# EAGLE design bridge (EAGLE 5.03)
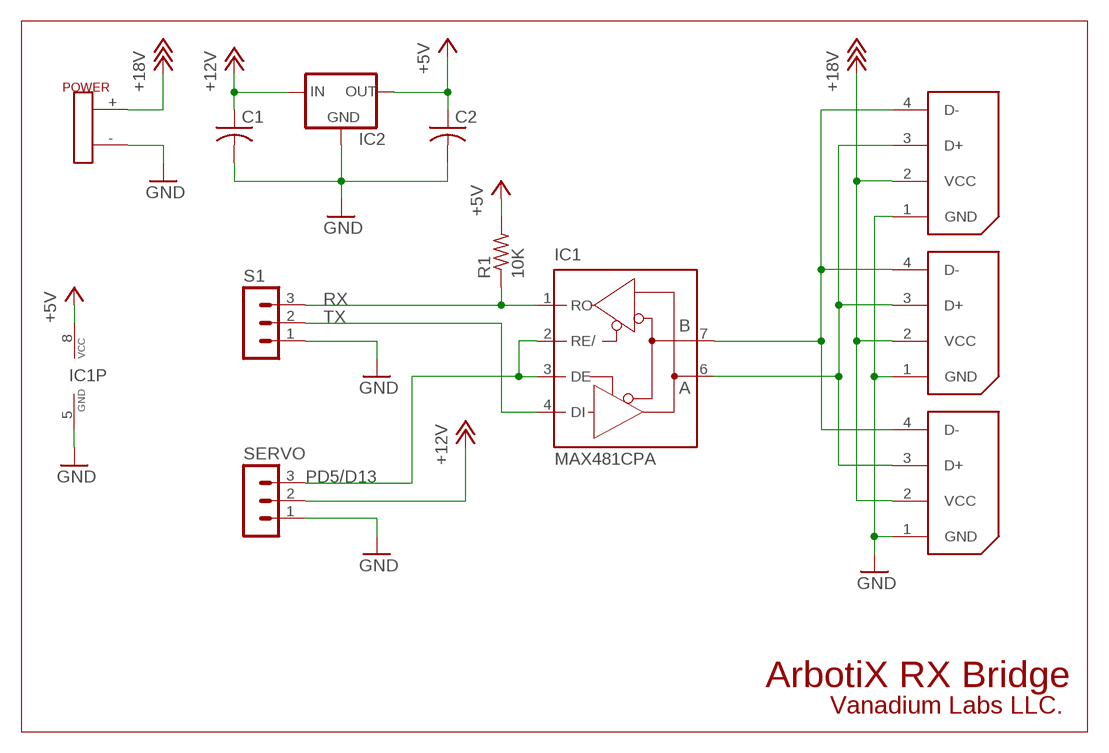
[diagram p0: schematic, sheet 1]

## Parts
C1  C-US025-025X050  [C025-025X050]
C2  C-US025-025X050  [C025-025X050]
IC1  MAX481CPA  [DIL08]
IC2  78LXX  [78LXX]
POWER  POWER  [POWER]
R1  10K  R-US_0204/5  [0204/5]
S1  MA03-1  [MA03-1]
SERVO  MA03-1  [MA03-1]
U$3  RX-64  [WM18888-ND]
U$4  RX-64  [WM18888-ND]
U$5  RX-64  [WM18888-ND]

## Nets
+5V: C2.1 IC1.8(VCC) IC2.OUT R1.2
+12V: C1.1 IC2.IN SERVO.2
+18V: POWER.+ U$3.2(VCC) U$4.2(VCC) U$5.2(VCC)
GND: C1.2 C2.2 IC1.5(GND) IC2.GND POWER.- S1.1 SERVO.1 U$3.1(GND) U$4.1(GND) U$5.1(GND)
N$2: IC1.7(B) U$3.4(D-) U$4.4(D-) U$5.4(D-)
N$3: IC1.6(A) U$3.3(D+) U$4.3(D+) U$5.3(D+)
PD5/D13: IC1.2(RE/) IC1.3(DE) SERVO.3
RX: IC1.1(RO) R1.1 S1.3
TX: IC1.4(DI) S1.2

## Notes on the sheet
- ArbotiX RX Bridge
- Vanadium Labs LLC.

## Library data of the parts
C1 C2 = rcl:C-US: CAPACITOR, American symbol
IC1 = maxim:MAX481CPA: RS485 TRANSEIVER
IC2 = v-reg:78LXX: VOLTAGE REGULATOR
POWER = robots:POWER
R1 = rcl:R-US_: RESISTOR, American symbol
S1 SERVO = con-lstb:MA03-1: PIN HEADER
U$3-U$5 = robots:RX-64

## Board
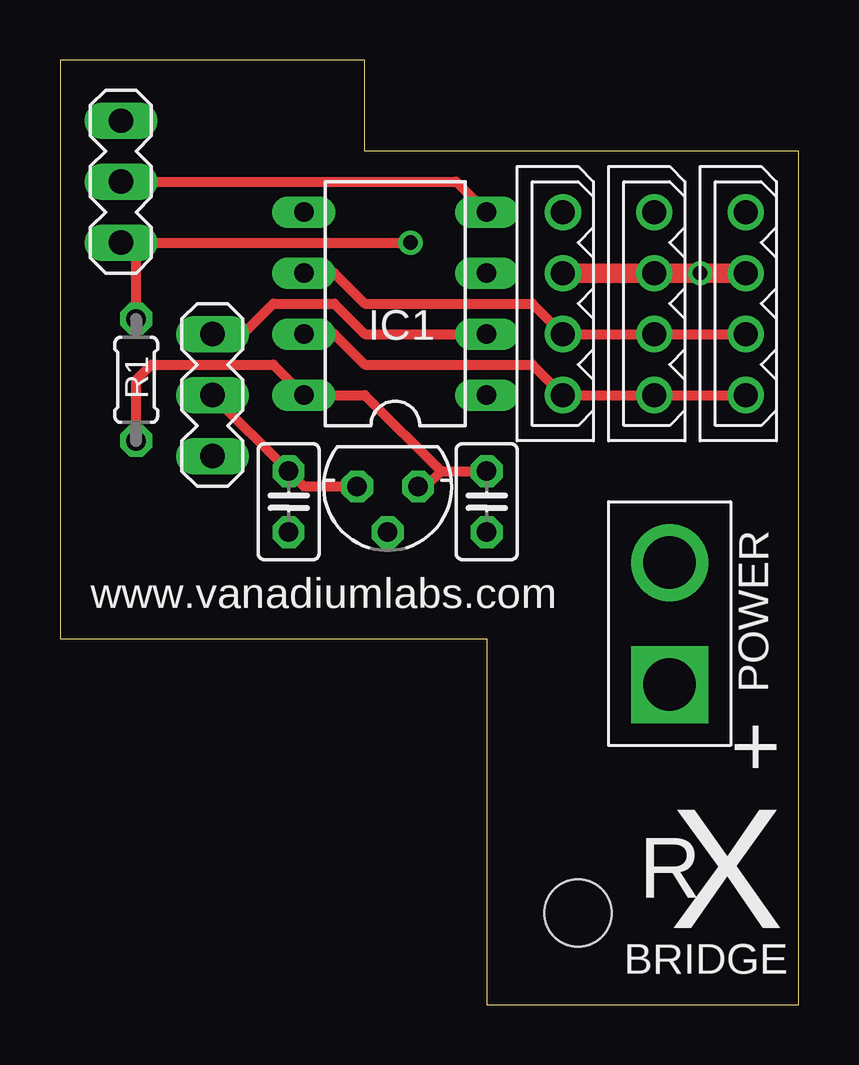
[diagram p1: board, top side]
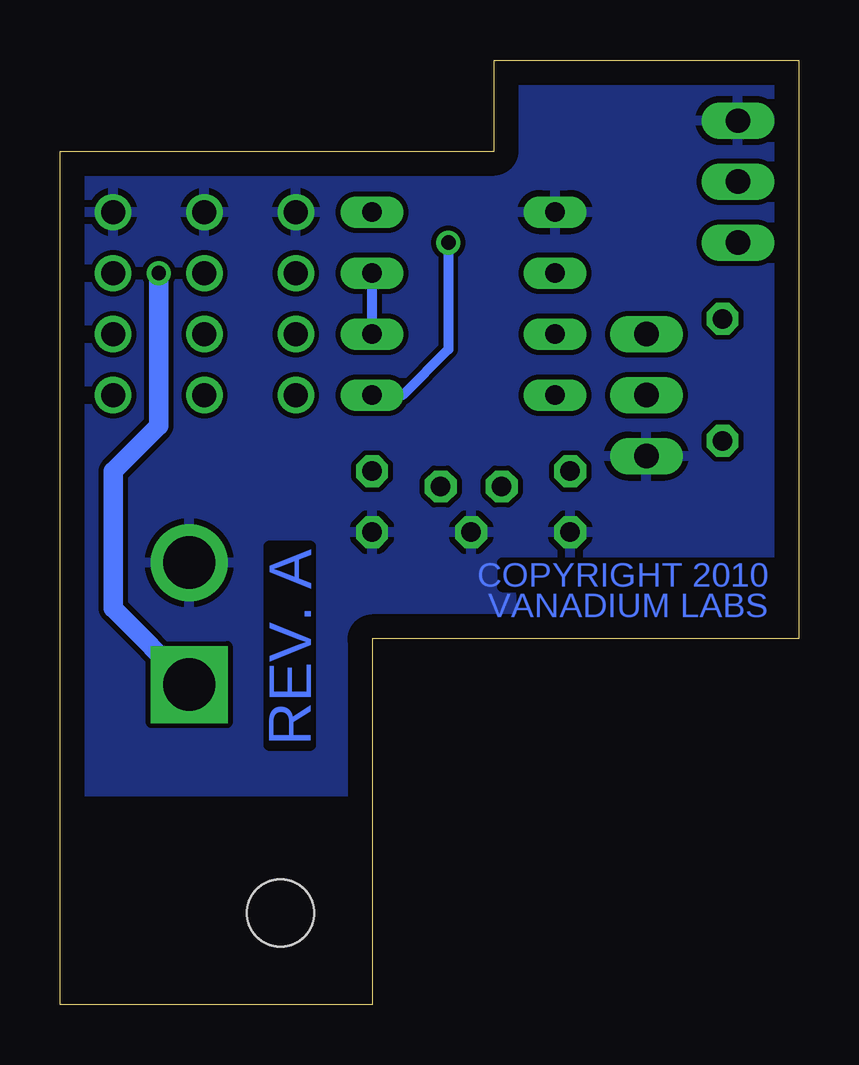
[diagram p2: board, bottom side, seen from below]

Size 30.79 x 39.36 mm. Coordinates in mm from the lower left corner, seen from the top.
Outline: 17.78,0 30.79,0 30.79,35.55 12.7,35.56 12.7,39.36 0,39.36 0,15.24 17.78,15.24 17.78,0
Copper layers (1*16): Top 0.035mm / dielectric 1.5mm / Bottom 0.035mm
Design rules "default *": minimum track width 10mil, minimum drill 24mil, track to track 8mil, track to pad 8mil, pad to pad 8mil, via to via 8mil, smd to smd 8mil, copper to edge 40mil, drill to drill 8mil, minimum pad ring 10mil, minimum via ring 8mil, stop-mask expansion 4mil, vias tented up to drill 24mil, thermal gap 10mil
Holes 2.8 mm at 21.59,3.81

### Footprints (pad centres in the part's own frame; a part is rotated, then mirrored left to right if it is on the bottom)
C025-025X050 = drill 0.813 octagon: 1 -1.27,0; 2 1.27,0
DIL08 = drill 0.813 long: 1 -3.81,-3.81; 2 -1.27,-3.81; 3 1.27,-3.81; 4 3.81,-3.81; 5 3.81,3.81; 6 1.27,3.81; 7 -1.27,3.81; 8 -3.81,3.81
78LXX = drill 0.813 octagon: GND 0,1.905; IN 1.27,0; OUT -1.27,0
POWER = drill 2.184 square: + 0,0 | drill 2.184 round: - 5.08,0
0204/5 = drill 0.813 octagon: 1 -2.54,0; 2 2.54,0
MA03-1 = drill 1.016 long: 1 -2.54,0; 2 0,0; 3 2.54,0
WM18888-ND = drill 1 round: 1 0,0; 2 -2.54,0; 3 -5.08,0; 4 -7.62,0

### Placement (x,y rotation side)
C1  9.52,20.95 270 top
C2  17.78,20.95 270 top
IC1  13.97,29.21 90 top
IC2  13.65,21.59 180 top
POWER  25.4,13.34 90 top
R1  3.17,26.04 270 top
S1  2.54,34.29 270 top
SERVO  6.35,25.4 90 top
U$3  24.76,33.02 90 top
U$4  28.57,33.02 90 top
U$5  20.95,33.02 90 top

### Tracks (layer width: path | path; a pad name or v marks a point on that pad's centre or on a via)
+5V
  Top 0.406: 15.88,22.23 12.7,25.4 IC1.8 8.89,26.67 3.81,26.67 3.17,26.04 R1.2 | IC2.OUT 15.24,21.59 15.88,22.23 | 15.88,22.23 C2.1
+12V
  Top 0.406: IC2.IN 10.16,21.59 C1.1 SERVO.2
+18V  (via drill 0.6)
  Top 0.813: U$5.2 U$3.2 v26.67,30.48 U$4.2
  Bottom 0.813: v26.67,30.48 26.67,24.13 28.57,22.23 28.57,16.51 POWER.+
GND
  pour Bottom: 0.63,38.73 12.06,38.73 12.06,34.92 29.84,34.92 30.48,8.89 1.27,8.89
N$2
  Top 0.406: U$4.4 U$3.4 U$5.4 19.68,26.67 12.7,26.67 11.43,27.94 IC1.7
N$3
  Top 0.406: U$4.3 U$3.3 U$5.3 19.68,29.21 12.7,29.21 11.43,30.48 IC1.6
PD5/D13
  Top 0.406: SERVO.3 7.62,27.94 8.89,29.21 11.43,29.21 12.7,27.94 IC1.2
  Bottom 0.406: IC1.2 IC1.3
RX  (via drill 0.6)
  Top 0.406: v14.6,31.75 S1.3 3.17,31.11 R1.1
  Bottom 0.406: v14.6,31.75 14.6,27.3 16.51,25.4 IC1.1
TX
  Top 0.406: S1.2 16.51,34.29 IC1.4

### Text on the board
Bottom: COPYRIGHT 2010 | VANADIUM LABS | REV. A
tNames: www.vanadiumlabs.com | + | R | X | BRIDGE